# Altium schematic sheet OECU_BASE4.SchDoc
size A4; SheetNumber: 4; SheetTotal: 6
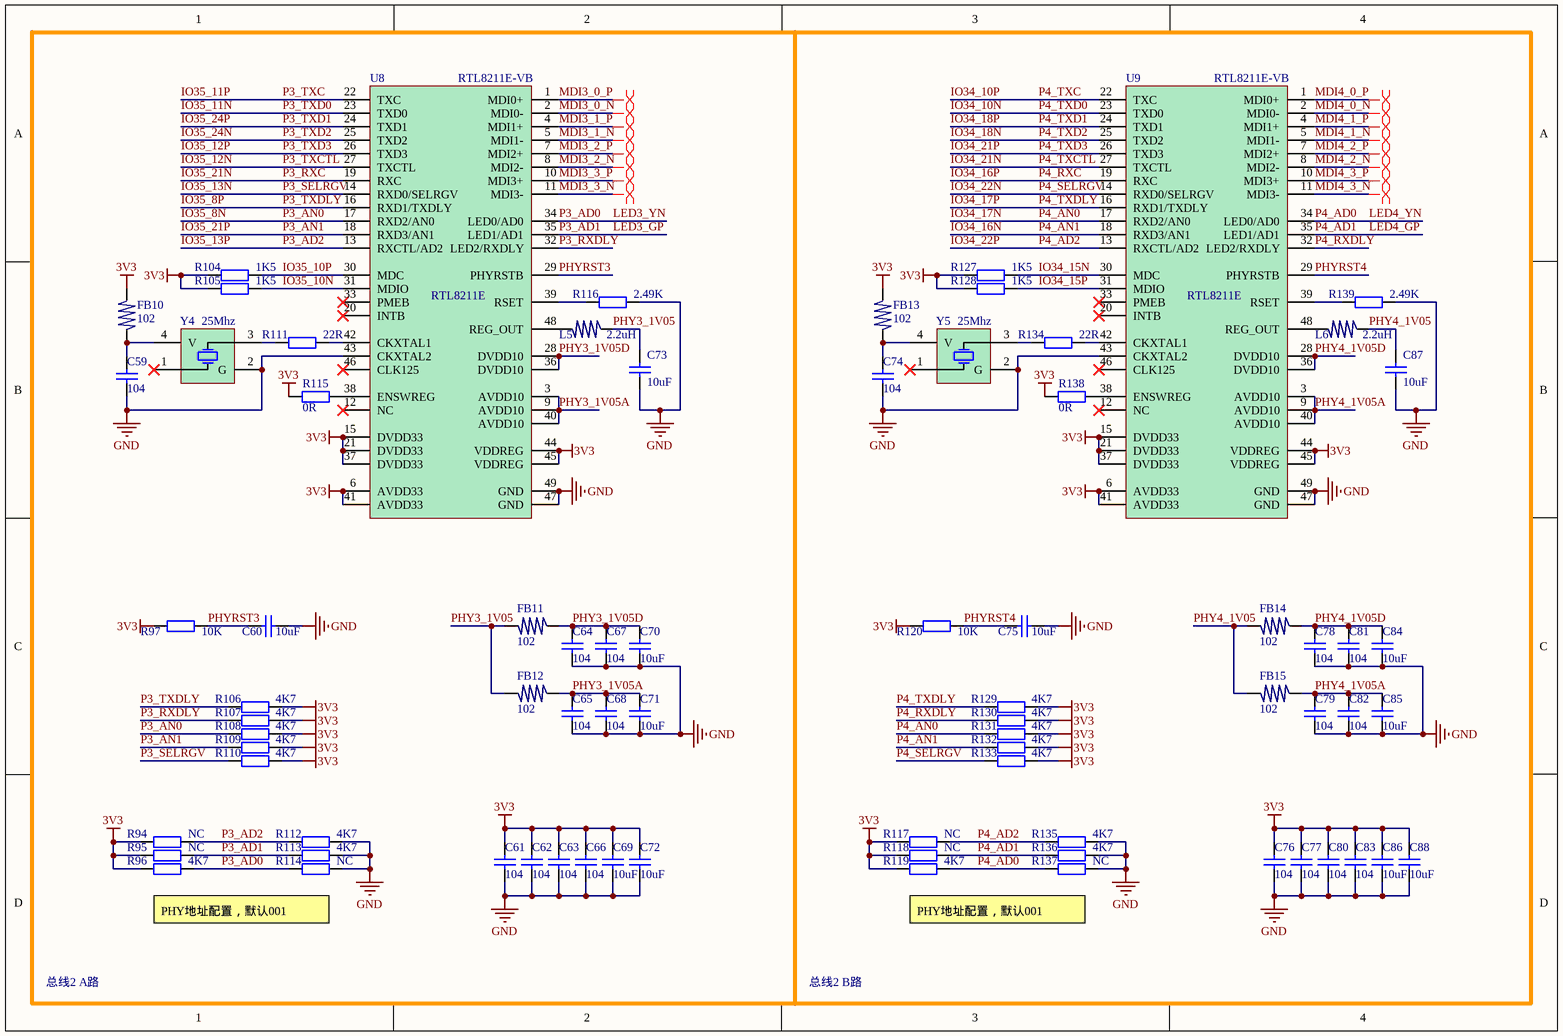
[diagram p0: OECU_BASE4.SchDoc]

## Parts
C59  104  [0402]
C60  10uF  [0402]
C61  104  [0402]
C62  104  [0402]
C63  104  [0402]
C64  104  [0402]
C65  104  [0402]
C66  104  [0402]
C67  104  [0402]
C68  104  [0402]
C69  10uF  [0402]
C70  10uF  [0402]
C71  10uF  [0402]
C72  10uF  [0402]
C73  10uF  [0402]
C74  104  [0402]
C75  10uF  [0402]
C76  104  [0402]
C77  104  [0402]
C78  104  [0402]
C79  104  [0402]
C80  104  [0402]
C81  104  [0402]
C82  104  [0402]
C83  104  [0402]
C84  10uF  [0402]
C85  10uF  [0402]
C86  10uF  [0402]
C87  10uF  [0402]
C88  10uF  [0402]
FB10  102  [0402]
FB11  102  [0603]
FB12  102  [0603]
FB13  102  [0402]
FB14  102  [0603]
FB15  102  [0603]
L5  2.2uH  [0805]
L6  2.2uH  [0805]
R94  NC  [R_0402]
R95  NC  [R_0402]
R96  4K7  [R_0402]
R97  10K  [R_0402]
R104  1K5  [R_0402]
R105  1K5  [R_0402]
R106  4K7  [R_0402]
R107  4K7  [R_0402]
R108  4K7  [R_0402]
R109  4K7  [R_0402]
R110  4K7  [R_0402]
R111  22R  [R_0402]
R112  4K7  [R_0402]
R113  4K7  [R_0402]
R114  NC  [R_0402]
R115  0R  [R_0402]
R116  2.49K  [R_0402]
R117  NC  [R_0402]
R118  NC  [R_0402]
R119  4K7  [R_0402]
R120  10K  [R_0402]
R127  1K5  [R_0402]
R128  1K5  [R_0402]
R129  4K7  [R_0402]
R130  4K7  [R_0402]
R131  4K7  [R_0402]
R132  4K7  [R_0402]
R133  4K7  [R_0402]
R134  22R  [R_0402]
R135  4K7  [R_0402]
R136  4K7  [R_0402]
R137  NC  [R_0402]
R138  0R  [R_0402]
R139  2.49K  [R_0402]
U8  RTL8211E-VB  [QFN48]
U9  RTL8211E-VB  [QFN48]
Y4  25Mhz  [XTAL_3225]
Y5  25Mhz  [XTAL_3225]

## Nets
3V3: C61.1 C62.1 C63.1 C66.1 C69.1 C72.1 C76.1 C77.1 C80.1 C83.1 C86.1 C88.1 FB10.2 FB13.2 R94.1 R95.1 R96.1 R97.1 R104.2 R105.2 R106.2 R107.2 R108.2 R109.2 R110.2 R115.2 R117.1 R118.1 R119.1 R120.1 R127.2 R128.2 R129.2 R130.2 R131.2 R132.2 R133.2 R138.2 U8.6(AVDD33) U8.15(DVDD33) U8.21(DVDD33) U8.37(DVDD33) U8.41(AVDD33) U8.44(VDDREG) U8.45(VDDREG) U9.6(AVDD33) U9.15(DVDD33) U9.21(DVDD33) U9.37(DVDD33) U9.41(AVDD33) U9.44(VDDREG) U9.45(VDDREG)
GND: C59.1 C60.2 C61.2 C62.2 C63.2 C64.1 C65.1 C66.2 C67.1 C68.1 C69.2 C70.1 C71.1 C72.2 C73.1 C74.1 C75.2 C76.2 C77.2 C78.1 C79.1 C80.2 C81.1 C82.1 C83.2 C84.1 C85.1 C86.2 C87.1 C88.2 R112.2 R113.2 R114.2 R116.2 R135.2 R136.2 R137.2 R139.2 U8.43(CKXTAL2) U8.47(GND) U8.49(GND) U9.43(CKXTAL2) U9.47(GND) U9.49(GND) Y4.2(G) Y5.2(G)
IO34_10N: U9.23(TXD0)  [also labelled P4_TXD0]
IO34_10P: U9.22(TXC)  [also labelled P4_TXC]
IO34_15N: R127.1 U9.30(MDC)
IO34_15P: R128.1 U9.31(MDIO)
IO34_16N: R132.1 U9.18(RXD3/AN1)  [also labelled P4_AN1]
IO34_16P: U9.19(RXC)  [also labelled P4_RXC]
IO34_17N: R131.1 U9.17(RXD2/AN0)  [also labelled P4_AN0]
IO34_17P: R129.1 U9.16(RXD1/TXDLY)  [also labelled P4_TXDLY]
IO34_18N: U9.25(TXD2)  [also labelled P4_TXD2]
IO34_18P: U9.24(TXD1)  [also labelled P4_TXD1]
IO34_21N: U9.27(TXCTL)  [also labelled P4_TXCTL]
IO34_21P: U9.26(TXD3)  [also labelled P4_TXD3]
IO34_22N: R133.1 U9.14(RXD0/SELRGV)  [also labelled P4_SELRGV]
IO34_22P: R117.2 R135.1 U9.13(RXCTL/AD2)  [also labelled P4_AD2]
IO35_8N: R108.1 U8.17(RXD2/AN0)  [also labelled P3_AN0]
IO35_8P: R106.1 U8.16(RXD1/TXDLY)  [also labelled P3_TXDLY]
IO35_10N: R105.1 U8.31(MDIO)
IO35_10P: R104.1 U8.30(MDC)
IO35_11N: U8.23(TXD0)  [also labelled P3_TXD0]
IO35_11P: U8.22(TXC)  [also labelled P3_TXC]
IO35_12N: U8.27(TXCTL)  [also labelled P3_TXCTL]
IO35_12P: U8.26(TXD3)  [also labelled P3_TXD3]
IO35_13N: R110.1 U8.14(RXD0/SELRGV)  [also labelled P3_SELRGV]
IO35_13P: R94.2 R112.1 U8.13(RXCTL/AD2)  [also labelled P3_AD2]
IO35_21N: U8.19(RXC)  [also labelled P3_RXC]
IO35_21P: R109.1 U8.18(RXD3/AN1)  [also labelled P3_AN1]
IO35_24N: U8.25(TXD2)  [also labelled P3_TXD2]
IO35_24P: U8.24(TXD1)  [also labelled P3_TXD1]
LED3_GP: R95.2 R113.1 U8.35(LED1/AD1)  [also labelled P3_AD1]
LED3_YN: R96.2 R114.1 U8.34(LED0/AD0)  [also labelled P3_AD0]
LED4_GP: R118.2 R136.1 U9.35(LED1/AD1)  [also labelled P4_AD1]
LED4_YN: R119.2 R137.1 U9.34(LED0/AD0)  [also labelled P4_AD0]
MDI3_0_N: U8.2(MDI0-)
MDI3_0_P: U8.1(MDI0+)
MDI3_1_N: U8.5(MDI1-)
MDI3_1_P: U8.4(MDI1+)
MDI3_2_N: U8.8(MDI2-)
MDI3_2_P: U8.7(MDI2+)
MDI3_3_N: U8.11(MDI3-)
MDI3_3_P: U8.10(MDI3+)
MDI4_0_N: U9.2(MDI0-)
MDI4_0_P: U9.1(MDI0+)
MDI4_1_N: U9.5(MDI1-)
MDI4_1_P: U9.4(MDI1+)
MDI4_2_N: U9.8(MDI2-)
MDI4_2_P: U9.7(MDI2+)
MDI4_3_N: U9.11(MDI3-)
MDI4_3_P: U9.10(MDI3+)
P3_RXDLY: R107.1 U8.32(LED2/RXDLY)
P4_RXDLY: R130.1 U9.32(LED2/RXDLY)
PHY3_1V05: C73.2 FB11.1 FB12.1 L5.1
PHY3_1V05A: C65.2 C68.2 C71.2 FB12.2 U8.3(AVDD10) U8.9(AVDD10) U8.40(AVDD10)
PHY3_1V05D: C64.2 C67.2 C70.2 FB11.2 U8.28(DVDD10) U8.36(DVDD10)
PHY4_1V05: C87.2 FB14.1 FB15.1 L6.1
PHY4_1V05A: C79.2 C82.2 C85.2 FB15.2 U9.3(AVDD10) U9.9(AVDD10) U9.40(AVDD10)
PHY4_1V05D: C78.2 C81.2 C84.2 FB14.2 U9.28(DVDD10) U9.36(DVDD10)
PHYRST3: C60.1 R97.2 U8.29(PHYRSTB)
PHYRST4: C75.1 R120.2 U9.29(PHYRSTB)
NetC59_2: C59.2 FB10.1 Y4.4(V)
NetC74_2: C74.2 FB13.1 Y5.4(V)
NetL5_2: L5.2 U8.48(REG_OUT)
NetL6_2: L6.2 U9.48(REG_OUT)
NetR111_1: R111.1 U8.42(CKXTAL1)
NetR111_2: R111.2 Y4.3(OP)
NetR115_1: R115.1 U8.38(ENSWREG)
NetR116_1: R116.1 U8.39(RSET)
NetR134_1: R134.1 U9.42(CKXTAL1)
NetR134_2: R134.2 Y5.3(OP)
NetR138_1: R138.1 U9.38(ENSWREG)
NetR139_1: R139.1 U9.39(RSET)

Not connected (* = marked no-connect by the designer): U8 12(NC)* 20(INTB)* 33(PMEB)* 46(CLK125)*; U9 12(NC)* 20(INTB)* 33(PMEB)* 46(CLK125)*; Y4 1(EC)*; Y5 1(EC)*

## Layout directives
differential pair: MDI3_0_N, MDI3_0_P, MDI3_1_N, MDI3_1_P, MDI3_2_N, MDI3_2_P, MDI3_3_N, MDI3_3_P, MDI4_0_N, MDI4_0_P, MDI4_1_N, MDI4_1_P, MDI4_2_N, MDI4_2_P, MDI4_3_N, MDI4_3_P

## Notes on the sheet
- PHY地址配置，默认001
- 总线2 A路
- 总线2 B路

## Library data of the parts
C59-C88 = CAP_0402: 贴片电容 0402
FB10 FB13 = FB_0402: 磁珠 0402
FB11 FB12 FB14 FB15 = FB_0603: 磁珠 0603
L5 L6 = L_0805: 电感 0805
R94-R97 R104-R120 R127-R139 = RES_0402: 电阻 0402
U8 U9 = RTL8211E: QFN48
Y4 Y5 = XTAL_3225